# Altium schematic sheet Sheet1.SchDoc
size A; SheetNumber: 1; SheetTotal: 1
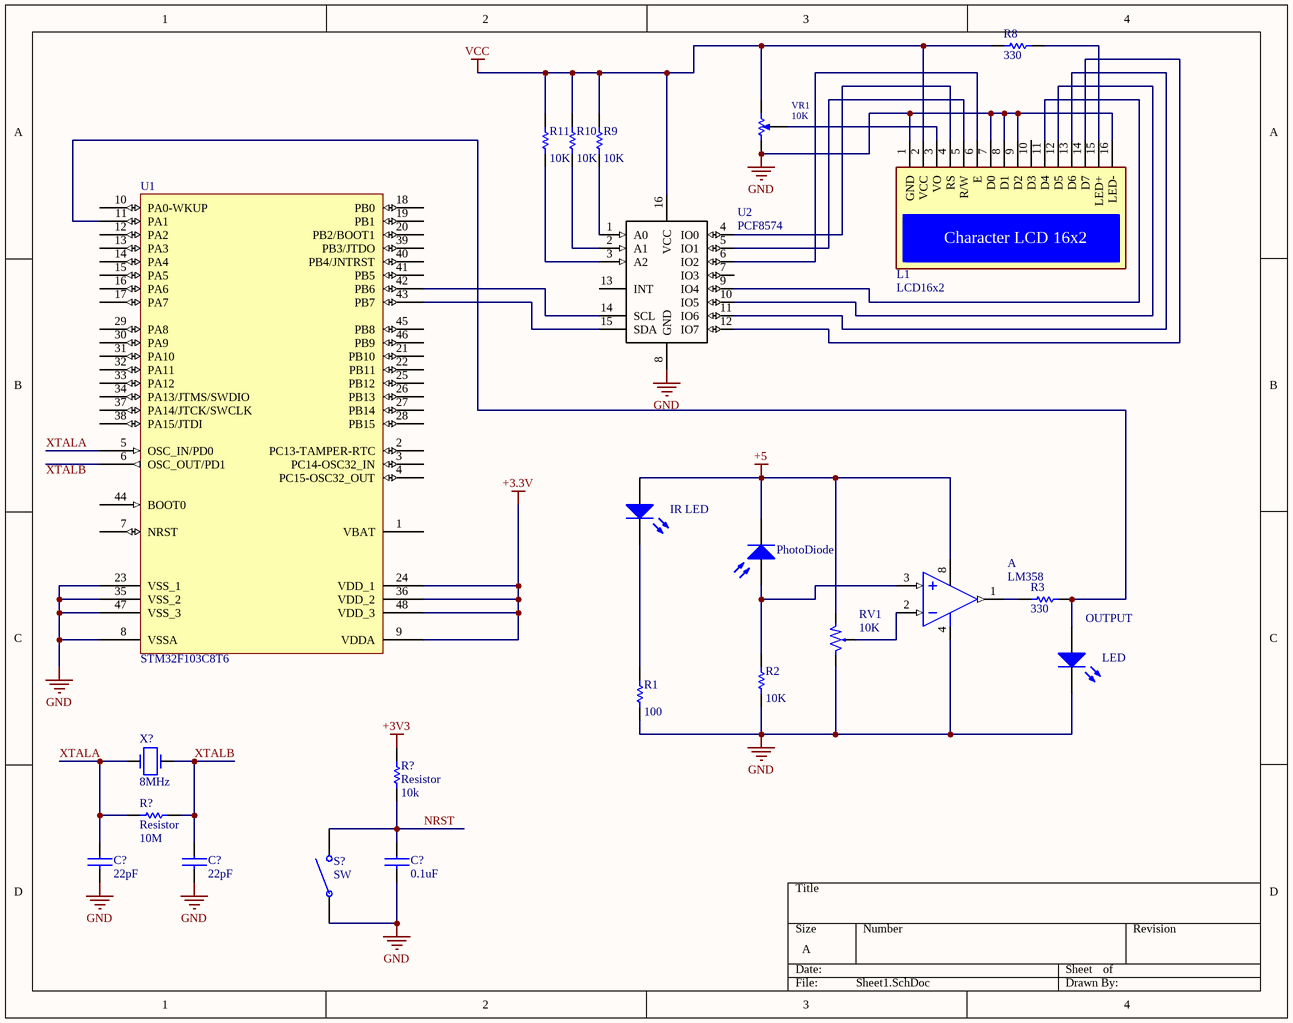
[diagram p0: Sheet1.SchDoc]

## Parts
(Parts that share a designator on the sheet are numbered #1, #2 ... from top to bottom, then left to right.)
?  LM358  [DIP8/W0.3]  (part A of 2)
C?#1  22pF  [CAP1206_THG]
C?#2  22pF  [CAP1206_THG]
C?#3  0.1uF  [CAP1206_THG]
IR_LED  (no value)  [LED_5mm]
L1  LCD16x2  [LCD16X2_3 HOLES]
LED  (no value)  [LED_5mm]
PhotoDiode  (no value)  [PIN2]
R1  value 100  [RESC3216L]
R2  value 10K  [RESC3216L]
R3  value 330  [RESC3216L]
R8  value 330  [RESC3216L]
R9  value 10K  [RESC3216L]
R10  value 10K  [RESC3216L]
R11  value 10K  [RESC3216L]
R?#1  Resistor  R: 10M  [RESC3216L]
R?#2  Resistor  value 10k  [RESC3216L]
RV1  10K  [VR]
S?  SW  [SW2]
U1  STM32F103C8T6  [LQFP48_L]
U2  PCF8574  [DIP16]
VR1  10K  [VARIABLE RESISTOR B10K]
X?  8MHz  [XTAL_THG_HC49/US]

## Nets
+3.3V: U1.9(VDDA) U1.24(VDD_1) U1.36(VDD_2) U1.48(VDD_3)
+3V3: R?#2.2
+5: ?.8(+V) IR_LED.1(A) PhotoDiode.2(K) RV1.1
GND: ?.4(-V) C?#1.2 C?#2.2 C?#3.2 L1.1(GND) L1.7(D0) L1.8(D1) L1.9(D2) L1.16(LED-) LED.2(K) R1.1 R2.1 RV1.3 S?.1 U1.8(VSSA) U1.23(VSS_1) U1.35(VSS_2) U1.47(VSS_3) U2.8(GND) VR1.3
VCC: L1.2(VCC) R8.2 R9.2 R10.2 R11.2 U2.16(VCC) VR1.1
NRST: C?#3.1 R?#2.1 S?.2
XTALA: C?#1.1 R?#1.1 U1.5(OSC_IN/PD0) X?.1(OSC1)
XTALB: C?#2.1 R?#1.2 X?.2(OSC2)
Net?_1: ?.1(OUT) R3.2
Net?_2: ?.2(IN-) RV1.2
Net?_3: ?.3(IN+) PhotoDiode.1(A) R2.2
NetIR_LED_2: IR_LED.2(K) R1.2
NetL1_3: L1.3(VO) VR1.2
NetL1_4: L1.4(RS) U2.4(IO0)
NetL1_5: L1.5(R/W) U2.5(IO1)
NetL1_6: L1.6(E) U2.6(IO2)
NetL1_11: L1.11(D4) U2.9(IO4)
NetL1_12: L1.12(D5) U2.10(IO5)
NetL1_13: L1.13(D6) U2.11(IO6)
NetL1_14: L1.14(D7) U2.12(IO7)
NetL1_15: L1.15(LED+) R8.1
NetLED_1: LED.1(A) R3.1 U1.11(PA1)
NetR9_1: R9.1 U2.1(A0)
NetR10_1: R10.1 U2.2(A1)
NetR11_1: R11.1 U2.3(A2)
NetU1_42: U1.42(PB6) U2.14(SCL)
NetU1_43: U1.43(PB7) U2.15(SDA)

Not connected (* = marked no-connect by the designer): L1 10(D3); U1 1(VBAT) 2(PC13-TAMPER-RTC) 3(PC14-OSC32_IN) 4(PC15-OSC32_OUT) 6(OSC_OUT/PD1) 7(NRST) 10(PA0-WKUP) 12(PA2) 13(PA3) 14(PA4) 15(PA5) 16(PA6) 17(PA7) 18(PB0) 19(PB1) 20(PB2/BOOT1) 21(PB10) 22(PB11) 25(PB12) 26(PB13) 27(PB14) 28(PB15) 29(PA8) 30(PA9) 31(PA10) 32(PA11) 33(PA12) 34(PA13/JTMS/SWDIO) 37(PA14/JTCK/SWCLK) 38(PA15/JTDI) 39(PB3/JTDO) 40(PB4/JNTRST) 41(PB5) 44(BOOT0) 45(PB8) 46(PB9); U2 7(IO3) 13(INT)

## Notes on the sheet
- OUTPUT
- Labels drawn without touching a wire or pin: XTALB

## Library data of the parts
? = LM358: Low-Power Dual Operational Amplifier; Value: LM358
C?#1-C?#3 = Cap_1nF_2.5KV
IR_LED LED = LED: Typical INFRARED GaAs LED; Published: 8-Jun-2000; LatestRevisionDate: 08-Jul-2005; LatestRevisionNote: Mech Layer 1 removed.; PackageReference: LED-0; Publisher: Altium Limited
L1 = LCD16x2: Character LCD 16x2
PhotoDiode = Photo Sen: Photosensitive Diode; Published: 24-Mar-1999; LatestRevisionDate: 17-Jul-2002; LatestRevisionNote: Re-released for DXP Platform.; PackageReference: PIN2; Publisher: Altium Limited
R1-R3 R8-R11 R?#1 R?#2 = Resistor: Semiconductor Resistor; Published: 8-Jun-2000; LatestRevisionDate: 17-Jul-2002; LatestRevisionNote: Re-released for DXP Platform.; PackageReference: AXIAL-0.5; Publisher: Altium Limited
RV1 = VR1: Var Resistor; Value: 10K
S? = SW: Switch; Published: 24-Mar-1999; LatestRevisionDate: 17-Jul-2002; LatestRevisionNote: Re-released for DXP Platform.; PackageReference: SPST-2; Publisher: Altium Limited
U1 = STM32F103C8T6: STM32 ARM-based 32-bit MCU with 64 Kbytes Flash, 48-pin LQFP, Industrial Temperature; Published: 30-May-2008; DatasheetVersion: rev6, Mar-2008; PackageVersion: Mar-2008; PackageReference: LQFP48; Publisher: Altium Limited; PackageDescription: 48-Pin Low-Profile Quad Flat Pack, 7 x 7 mm Body, 0.5 mm Pitch (LQFP48); ComponentLink1Description: Manufacturer Link; ComponentLink1URL: www.st.com/stm32; ComponentLink2Description: Datasheet; ComponentLink2URL: http://www.st.com/stonline/products/literature/ds/13587.pdf
U2 = PCF8574: I2C PORT EXPANDER; Manufacturer Part Number: PCF8574T/3,512; Manufacturer: NXP Semiconductors; Includes: POR; Interface: I²C; Interrupt Output: Yes; Number of I /O: 8; Voltage - Supply: 2.5 V ~ 6 V; Frequency - Clock: 100KHz; Supplier 1: Digi-Key; Supplier Part Number 1: 568-1076-5-ND; Package / Case: 16-SOIC (7.5mm Width); Category: Integrated Circuits (ICs); Supplier Part Number: 568-1076-5-ND; Operating Temperature: -40°C ~ 85°C; Packaging: Tube; RoHS: RoHS Compliant; Supplier: Digi-Key
VR1 = Variable Resistor: Square Trimming Potentiometer; AEMS Code: 1400226
X? = XTAL_9B-8.000MAAE-B: CRYSTAL 8.0000MHZ 12PF T/H; Manufacturer: TXC CORPORATION; Frequency Stability: ±30ppm; Operating Mode: Fundamental; Supplier 1: Digi-Key; Manufacturer Part Number: 9B-8.000MAAE-B; RoHS: RoHS Compliant; Category: Crystals, Oscillators, Resonators; Stock 1: 0; Pricing 1: 1000=0.192 (USD); Packaging: Bulk; Part Status: Active; Type: MHz Crystal; Frequency Tolerance: ±30ppm; Load Capacitance: 12pF; Operating Temperature: -20°C ~ 70°C; Ratings: -; Mounting Type: Through Hole; Package / Case: HC49/US; Size / Dimension: 0.453" L x 0.197" W (11.50mm x 5.00mm); Height - Seated (Max): 0.145" (3.68mm); ComponentLink1URL: http://www.txccorp.com/download/products/quartz_crystals/2015TXC_9B_33.pdf; ComponentLink1Description: http://www.txccorp.com/download/products/quartz_crystals/2015TXC_9B_33.pdf; Supplier Part Number 1: 9B-8.000MAAE-B-ND